# EAGLE design ICE_mod_hbridge-mpc17511 (EAGLE 5.06)
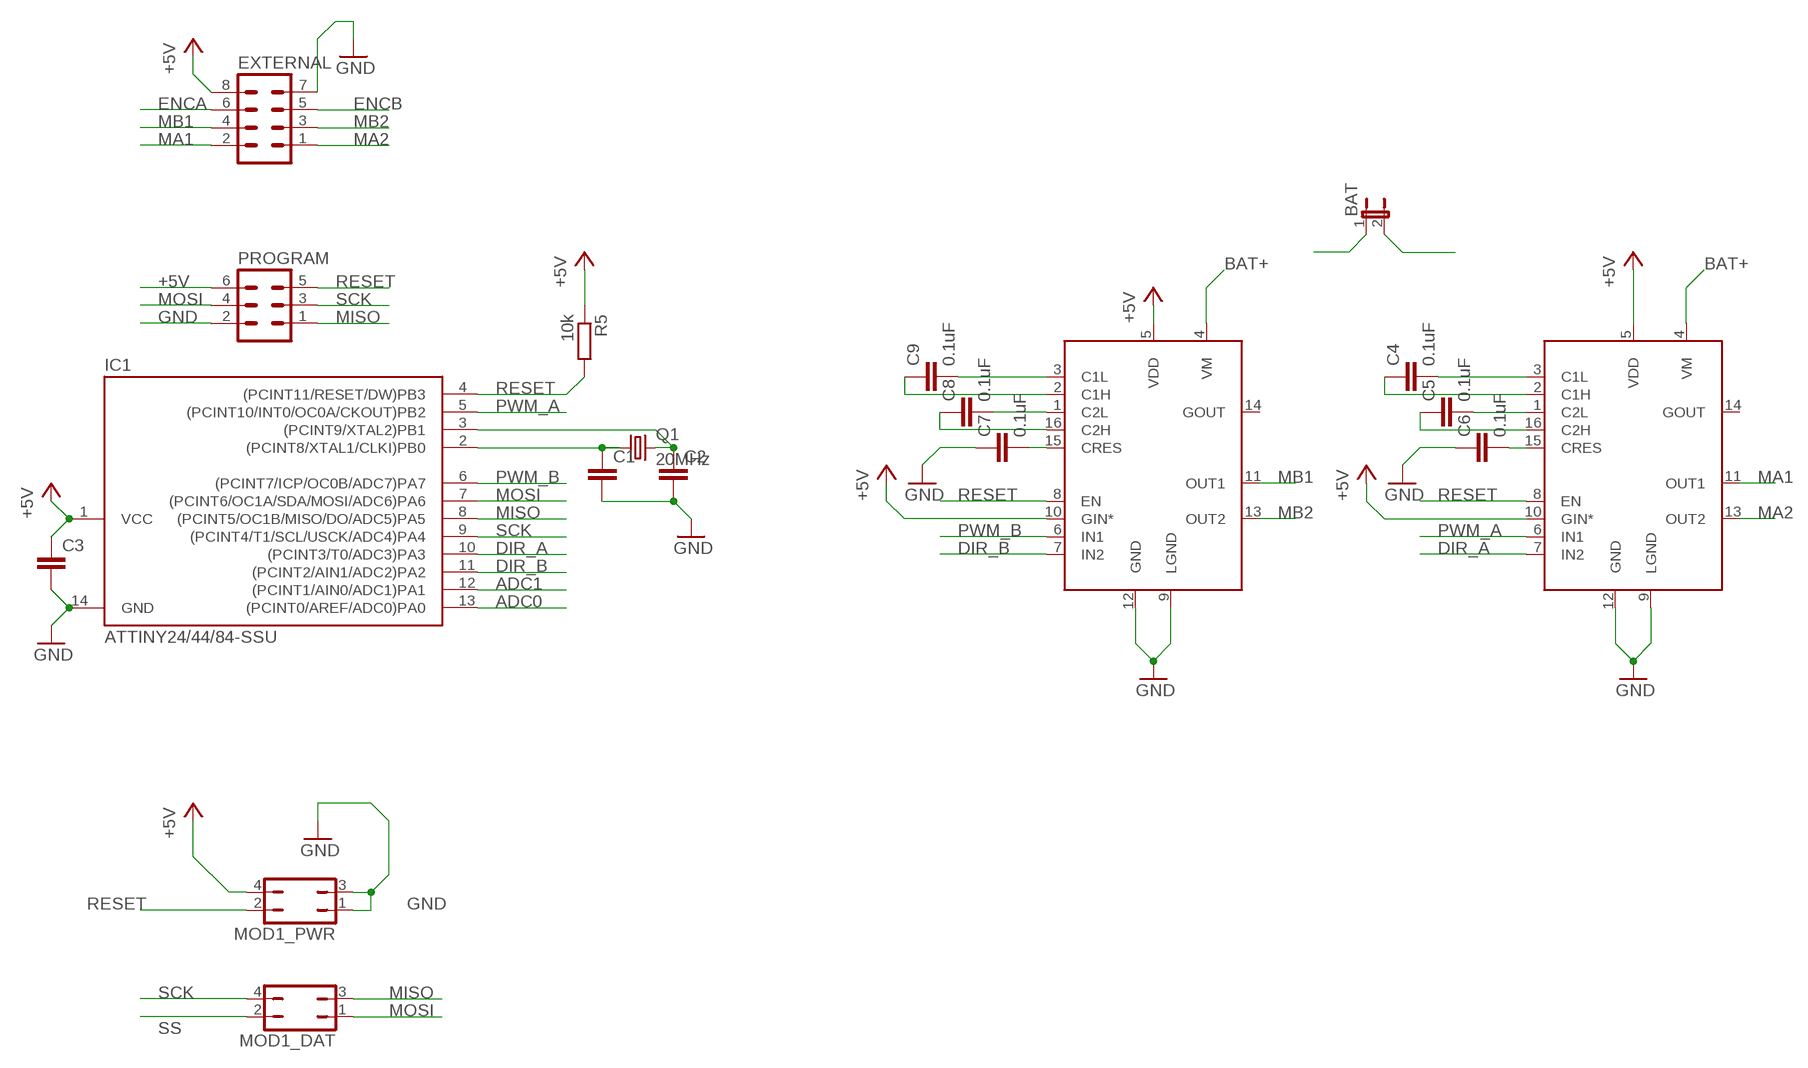
[diagram p0: schematic, sheet 1]

## Parts
BAT  JP1E  [JP1]
C1  C-EUC0805K  [C0805K]
C2  C-EUC0805K  [C0805K]
C3  C-EUC0805K  [C0805K]
C4  0.1uF  C-EUC0805K  [C0805K]
C5  0.1uF  C-EUC0805K  [C0805K]
C6  0.1uF  C-EUC0805K  [C0805K]
C7  0.1uF  C-EUC0805K  [C0805K]
C8  0.1uF  C-EUC0805K  [C0805K]
C9  0.1uF  C-EUC0805K  [C0805K]
EXTERNAL  MA04-2  [MA04-2]
IC1  ATTINY24/44/84-SSU  [SOIC14]
MOD1_DAT  JP2Q  [JP2Q]
MOD1_PWR  JP2Q  [JP2Q]
PROGRAM  MA03-2  [MA03-2]
Q1  20MHz  CRYSTALHC49S  [HC49/S]
R5  10k  R-EU_M0805  [M0805]
U$1  MPC17511A  [VMFP16]
U$2  MPC17511A  [VMFP16]

## Nets
+5V: C3.1 EXTERNAL.8 IC1.1(VCC) MOD1_PWR.4 PROGRAM.6 R5.1 U$1.5(VDD) U$1.10(GIN*) U$2.5(VDD) U$2.10(GIN*)
ADC0: IC1.13((PCINT0/AREF/ADC0)PA0)
ADC1: IC1.12((PCINT1/AIN0/ADC1)PA1)
BAT+: BAT.1 U$1.4(VM) U$2.4(VM)
DIR_A: IC1.10((PCINT3/T0/ADC3)PA3) U$1.7(IN2)
DIR_B: IC1.11((PCINT2/AIN1/ADC2)PA2) U$2.7(IN2)
ENCA: EXTERNAL.6
ENCB: EXTERNAL.5
GND: BAT.2 C1.2 C2.2 C3.2 C6.1 C7.1 EXTERNAL.7 IC1.14(GND) MOD1_PWR.1 MOD1_PWR.3 PROGRAM.2 U$1.9(LGND) U$1.12(GND) U$2.9(LGND) U$2.12(GND)
MA1: EXTERNAL.2 U$1.11(OUT1)
MA2: EXTERNAL.1 U$1.13(OUT2)
MB1: EXTERNAL.4 U$2.11(OUT1)
MB2: EXTERNAL.3 U$2.13(OUT2)
MISO: IC1.8((PCINT5/OC1B/MISO/DO/ADC5)PA5) MOD1_DAT.3 PROGRAM.1
MOSI: IC1.7((PCINT6/OC1A/SDA/MOSI/ADC6)PA6) MOD1_DAT.1 PROGRAM.4
N$1: C2.1 IC1.3((PCINT9/XTAL2)PB1) Q1.2
N$2: C1.1 IC1.2((PCINT8/XTAL1/CLKI)PB0) Q1.1
N$13: C6.2 U$1.15(CRES)
N$14: C5.2 U$1.1(C2L)
N$15: C5.1 U$1.16(C2H)
N$16: C4.2 U$1.3(C1L)
N$17: C4.1 U$1.2(C1H)
N$19: C7.2 U$2.15(CRES)
N$20: C8.2 U$2.1(C2L)
N$21: C8.1 U$2.16(C2H)
N$22: C9.2 U$2.3(C1L)
N$23: C9.1 U$2.2(C1H)
PWM_A: IC1.5((PCINT10/INT0/OC0A/CKOUT)PB2) U$1.6(IN1)
PWM_B: IC1.6((PCINT7/ICP/OC0B/ADC7)PA7) U$2.6(IN1)
RESET: IC1.4((PCINT11/RESET/DW)PB3) MOD1_PWR.2 PROGRAM.5 R5.2 U$1.8(EN) U$2.8(EN)
SCK: IC1.9((PCINT4/T1/SCL/USCK/ADC4)PA4) MOD1_DAT.4 PROGRAM.3
SS: MOD1_DAT.2
Unconnected: U$1.14(GOUT) U$2.14(GOUT)

## Library data of the parts
BAT = jumper:JP1E: JUMPER
C1-C9 = rcl:C-EU: CAPACITOR, European symbol
EXTERNAL = con-lstb:MA04-2: PIN HEADER
IC1 = attiny24_44_84:ATTINY24/44/84
MOD1_DAT MOD1_PWR = jumper:JP2Q: JUMPER
PROGRAM = con-lstb:MA03-2: PIN HEADER
Q1 = crystal:CRYSTAL: CRYSTAL
R5 = resistor:R-EU_: RESISTOR, European symbol
U$1 U$2 = freescale:MPC17511A

## Board
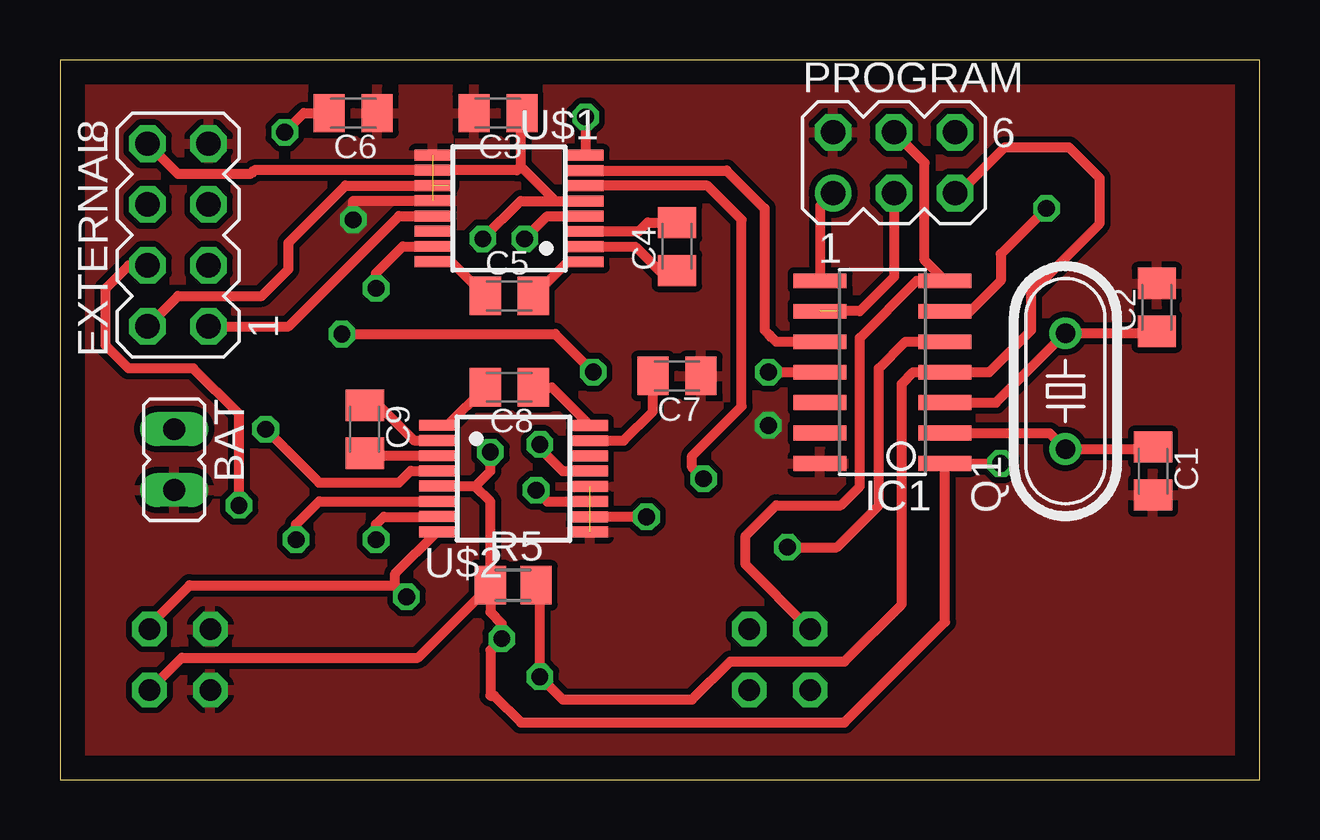
[diagram p1: board, top side]
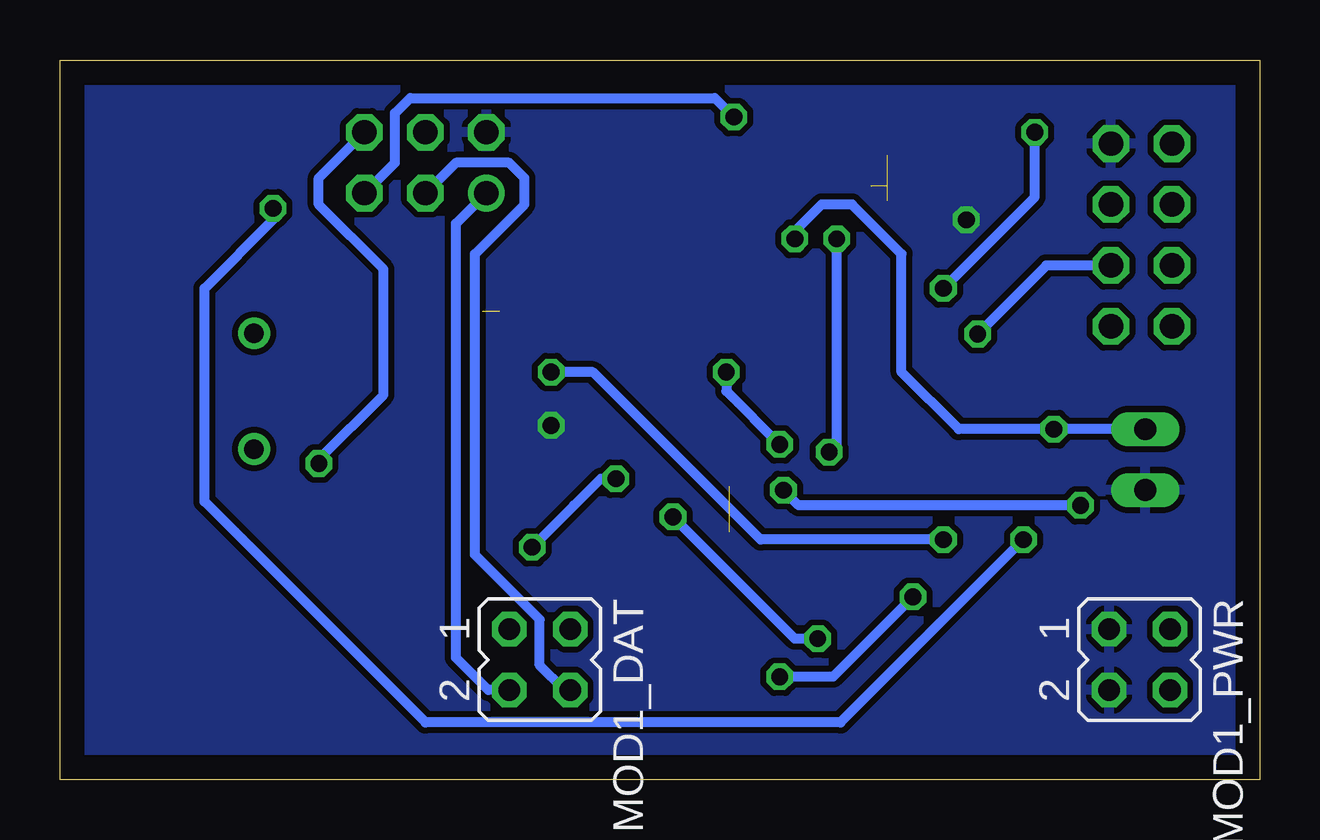
[diagram p2: board, bottom side, seen from below]

Size 50 x 30 mm. Coordinates in mm from the lower left corner, seen from the top.
Outline: 0,0 50,0 50,30 0,30 0,0
Copper layers (1*16): Top 0.035mm / dielectric 1.5mm / Bottom 0.035mm
Design rules "olimex-8mils": minimum track width 8mil, minimum drill 0.6mm, track to track 8mil, track to pad 8mil, pad to pad 8mil, via to via 8mil, smd to smd 8mil, copper to edge 40mil, drill to drill 10mil, minimum pad ring 10mil, minimum via ring 8mil, stop-mask expansion 0mil, vias tented up to drill 0mil, thermal gap 10mil

### Footprints (pad centres in the part's own frame; a part is rotated, then mirrored left to right if it is on the bottom)
JP1 = drill 0.914 long: 1 0,-1.27; 2 0,1.27
C0805K = smd 1.3 x 1.6: 1 -1,0; 2 1,0
MA04-2 = drill 1.016 octagon: 1 -3.81,-1.27; 2 -3.81,1.27; 3 -1.27,-1.27; 4 -1.27,1.27; 5 1.27,-1.27; 6 1.27,1.27; 7 3.81,-1.27; 8 3.81,1.27
SOIC14 = smd 0.61 x 2.21: 1 -3.81,-2.603; 2 -2.54,-2.603; 3 -1.27,-2.603; 4 0,-2.603; 5 1.27,-2.603; 6 2.54,-2.603; 7 3.81,-2.603; 8 3.81,2.603; 9 2.54,2.603; 10 1.27,2.603; 11 0,2.603; 12 -1.27,2.603; 13 -2.54,2.603; 14 -3.81,2.603
JP2Q = drill 0.914 octagon: 1 -1.27,-1.27; 2 -1.27,1.27; 3 1.27,-1.27; 4 1.27,1.27
MA03-2 = drill 1.016 round: 1 -2.54,-1.27 | drill 1.016 octagon: 2 -2.54,1.27; 3 0,-1.27; 4 0,1.27; 5 2.54,-1.27; 6 2.54,1.27
HC49/S = drill 0.813 round: 1 -2.413,0; 2 2.413,0
M0805 = smd 1.3 x 1.6: 1 -0.95,0; 2 0.95,0
VMFP16 = smd 0.45 x 1.5: 1 -2.232,-3.18; 2 -1.597,-3.18; 3 -0.963,-3.18; 4 -0.328,-3.18; 5 0.307,-3.18; 6 0.943,-3.18; 7 1.577,-3.18; 8 2.212,-3.18; 9 2.223,3.2; 10 1.587,3.2; 11 0.953,3.2; 12 0.318,3.2; 13 -0.318,3.2; 14 -0.953,3.2; 15 -1.587,3.2; 16 -2.223,3.2

### Placement (x,y rotation side)
BAT  4.76,13.34 180 top
C1  45.56,12.86 270 top
C2  45.72,19.69 90 top
C3  18.26,27.78 180 top
C4  25.72,22.22 90 top
C5  18.73,20.16 0 top
C6  12.22,27.78 180 top
C7  25.72,16.83 180 top
C8  18.73,16.35 180 top
C9  12.7,14.6 270 top
EXTERNAL  4.92,22.7 90 top
IC1  34.29,16.99 90 top
MOD1_DAT  30,5 270 bottom
MOD1_PWR  5,5 270 bottom
PROGRAM  34.77,25.72 0 top
Q1  41.91,16.19 90 top
R5  18.89,8.1 0 top
U$1  18.73,23.81 90 top
U$2  18.89,12.54 270 top

### Tracks (layer width: path | path; a pad name or v marks a point on that pad's centre or on a via)
+5V  (via drill 0.7)
  Top 0.406: v39.21,13.18 IC1.1 36.89,6.57 32.7,2.38 19.21,2.38 18.1,3.49 17.94,3.49 17.94,5.4 v18.41,5.87 18.41,6.51 17.94,6.99 R5.1 | v39.21,13.18 | MOD1_PWR.4 5.08,5.08 14.93,5.08 R5.1 | EXTERNAL.8 4.92,25.24 7.94,25.24 8.1,25.4 U$1.10 19.05,25.4 19.21,25.56 | v24.45,10.95 U$2.10 | U$2.10 | R5.1 17.94,11.59 17.3,12.22 | 17.3,12.22 U$2.5 | 20.65,24.12 U$1.5 | 20.65,24.12 19.21,25.56 | 19.21,25.56 19.21,27.73 C3.1 | 20.65,24.12 19.2,24.12 v17.62,22.54 | v17.94,13.65 17.94,12.86 17.3,12.22
  Bottom 0.406: PROGRAM.6 39.21,25.08 39.21,23.97 36.51,21.27 36.51,16.03 39.21,13.34 v39.21,13.18 | v18.41,5.87 19.37,5.87 v24.45,10.95 | v17.62,22.54 17.62,13.97 v17.94,13.65
BAT+  (via drill 0.7)
  Top 0.406: U$2.4 14.62,12.87 14.13,12.38 10.79,12.38 v8.57,14.61 | U$1.4 20.31,23.48 v19.37,22.54
  Bottom 0.406: BAT.1 v8.57,14.61 12.54,14.61 14.92,16.99 14.92,21.91 16.99,23.97 18.26,23.97 19.37,22.86 v19.37,22.54
DIR_A
  Top 0.406: U$1.7 27.79,25.39 29.37,23.81 29.37,18.73 29.53,18.57 | 29.53,18.57 29.69,18.41 | IC1.10 29.84,18.26 29.53,18.57
DIR_B  (via drill 0.7)
  Top 0.406: IC1.11 v29.53,16.99 | v13.18,10 13.18,10.64 13.49,10.95 U$2.7
  Bottom 0.406: v29.53,16.99 27.78,16.99 20.8,10 v13.18,10
GND  (via drill 0.7)  (2 unrouted)
  Top 0.406: U$1.9 15.53,26.06 | U$1.12 12.22,24.13 v12.22,23.34
  other vias: 29.53,14.76
  pour Bottom (isolate 0.254): -0.16,0.32 0,0.32 0,30.32 49.85,30.32 49.85,29.84 50.01,29.84 50.01,-0.16
  pour Top (isolate 0.254): 0.16,-0.16 0.16,29.84 49.85,29.84 49.85,0.16
MA1  (1 unrouted)
  Top 0.406: EXTERNAL.2 | EXTERNAL.2 4.92,20.16 8.41,20.16 9.53,21.27 9.53,22.38 11.91,24.77 16.19,24.77
MA2
  Top 0.406: U$1.13 14.13,23.5 9.53,18.89 EXTERNAL.1
MB1  (via drill 0.7)
  Top 0.406: EXTERNAL.4 2.86,21.43 1.91,20.48 1.91,18.1 2.86,17.14 5.56,17.14 7.46,15.24 v7.46,11.43 | v19.84,12.06 20.24,11.67 | 20.24,11.67 20.32,11.59 | 20.32,11.59 U$2.11 | 20.24,11.67 20.32,11.59
  Bottom 0.406: v7.46,11.43 19.21,11.43 v19.84,12.06
MB2  (via drill 0.7)
  Top 0.406: v11.75,18.57 20.64,18.57 v22.23,16.99 | v20,13.97 20,13.81 20.95,12.86 U$2.13 | U$2.13
  Bottom 0.406: EXTERNAL.3 8.89,21.43 v11.75,18.57 | v22.23,16.99 22.23,16.19 v20,13.97
MISO
  Top 0.406: IC1.8 31.69,23.91 PROGRAM.1
  Bottom 0.406: MOD1_DAT.3 32.15,3.73 33.5,5.08 33.5,23.18 PROGRAM.1
MOSI
  Top 0.406: PROGRAM.4 36.04,25.72 36.04,21.65 IC1.7 35.72,20.8 33.34,18.41 33.34,12.22 32.54,11.43 29.84,11.43 28.57,10.16 28.57,8.96 MOD1_DAT.1
N$1
  Top 0.406: IC1.3 39.02,15.72 Q1.2 45.64,18.61 C2.1
N$2
  Top 0.406: IC1.2 41.24,14.45 Q1.1 45.48,13.78 C1.1
N$13  (via drill 0.7)
  Top 0.406: C6.2 10.16,27.78 v9.37,26.99 | v13.18,20.48 13.18,21.11 14.29,22.23 U$1.15
  Bottom 0.406: v9.37,26.99 9.37,24.29 v13.18,20.48
N$14
  Top 0.406: U$1.1 21.15,21.58 C5.2
N$15
  Top 0.406: U$1.16 16.3,21.59 C5.1
N$16
  Top 0.406: C4.2 24.5,23.23 24.13,22.86 21.92,22.86 U$1.3
N$17
  Top 0.406: U$1.2 23.98,22.21 25.24,20.95 25.45,20.95 C4.1
N$19
  Top 0.406: C7.2 24.72,15.35 23.5,14.13 U$2.15 | U$2.15
N$20
  Top 0.406: U$2.1 16.16,14.77 C8.2
N$21
  Top 0.406: C8.1 20.5,16.35 U$2.16
N$22
  Top 0.406: U$2.3 12.8,13.5 C9.2
N$23
  Top 0.406: U$2.2 14.75,14.14 13.34,15.56 12.75,15.56 C9.1
PWM_A  (via drill 0.7)
  Top 0.406: U$1.6 27,24.75 28.42,23.34 28.42,15.56 26.35,13.49 26.35,13.02 v26.83,12.54 | v30.32,9.68 32.38,9.68 34.13,11.43 34.13,17.14 35.24,18.26 IC1.5 | IC1.5
  Bottom 0.406: v30.32,9.68 28.57,11.43 27.46,12.54 v26.83,12.54
PWM_B  (via drill 0.7)
  Top 0.406: IC1.6 37.94,19.53 39.21,20.8 39.21,21.91 v41.12,23.81 | v9.84,10 9.84,10.64 10.8,11.6 U$2.6
  Bottom 0.406: v41.12,23.81 41.12,23.34 43.97,20.48 43.97,11.59 34.77,2.38 17.46,2.38 v9.84,10
RESET  (via drill 0.7)
  Top 0.406: IC1.4 38.73,16.99 40.48,18.73 40.48,20.32 43.34,23.18 43.34,25.08 42.07,26.35 39.37,26.35 37.47,24.45 PROGRAM.5 | IC1.4 | MOD1_PWR.2 3.73,6.43 5.4,8.1 13.97,8.1 | 13.97,8.1 v14.45,7.62 | R5.2 20,7.93 v20,4.29 20.95,3.33 26.35,3.33 27.94,4.92 32.7,4.92 35.08,7.3 35.08,16.51 35.56,16.99 IC1.4 | v21.91,27.62 U$1.8 | 13.97,8.1 13.97,8.59 U$2.8
  Bottom 0.406: v14.45,7.62 17.78,4.29 v20,4.29 | PROGRAM.5 36.04,25.72 36.04,27.78 35.4,28.42 22.7,28.42 v21.91,27.62
SCK  (1 unrouted)
  Top 0.406: PROGRAM.3 34.77,20.95 33.34,19.53 32.38,19.53
  Bottom 0.406: PROGRAM.3 33.5,25.72 31.27,25.72 30.64,25.08 30.64,23.97 32.7,21.91 32.7,9.37 30,6.67 30,4.76 28.97,3.73 MOD1_DAT.4